# EAGLE design Dummy Load (EAGLE 6.5.0)
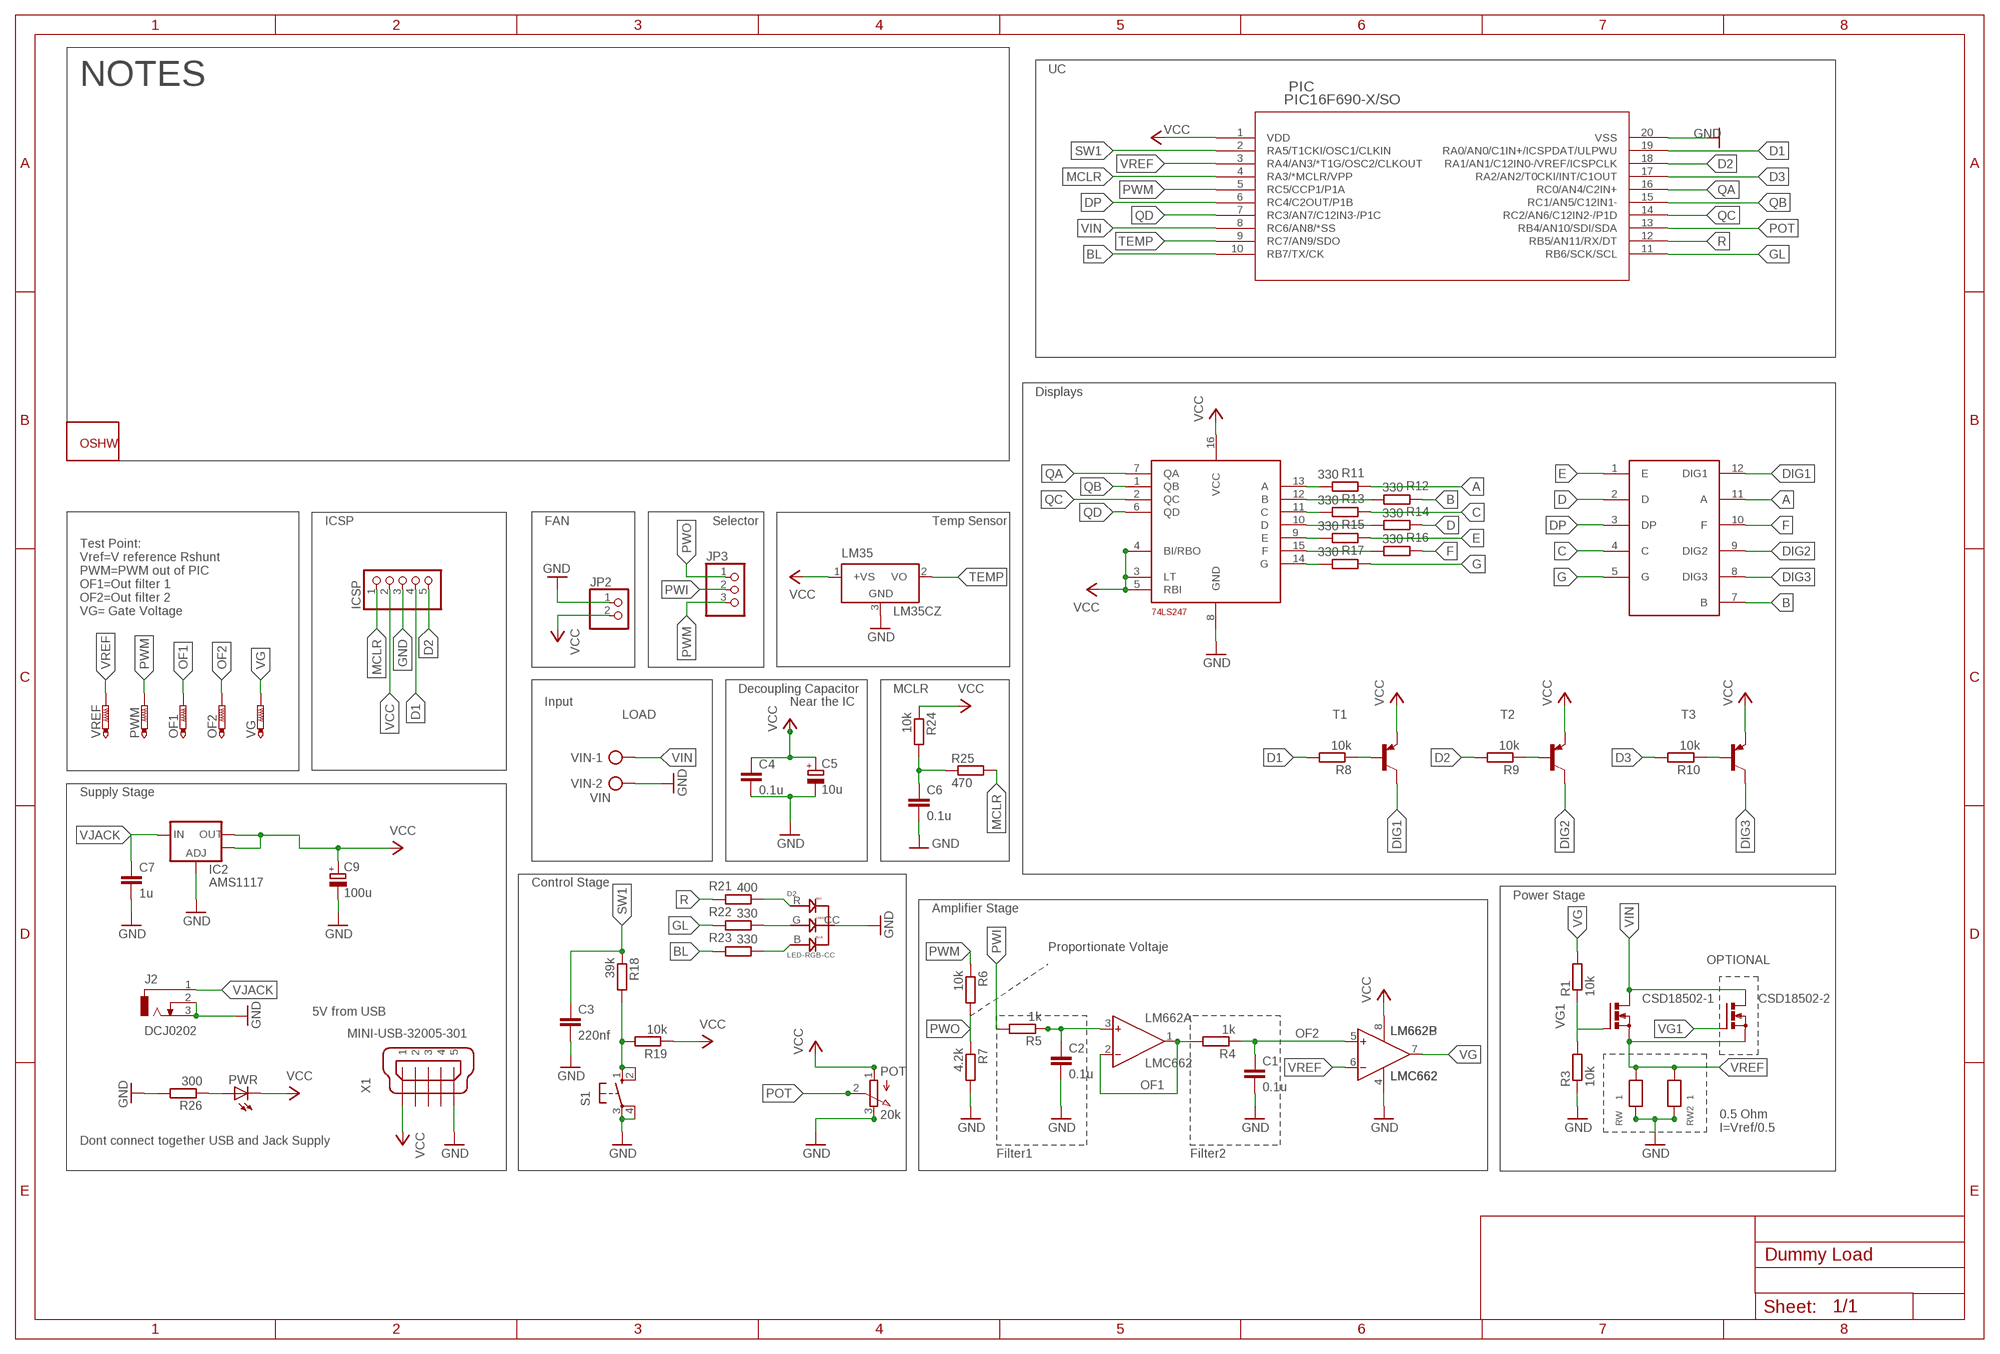
[diagram p0: schematic, sheet 1]

## Parts
74LS247  BCD-7  TLC5916/17  [SOIC-16]
C1  0.1u  C-EUC0805  [C0805]
C2  0.1u  C-EUC0805  [C0805]
C3  220nf  C-EUC0805  [C0805]
C4  0.1u  C-EUC0805  [C0805]
C5  10u  CPOL-EU153CLV-0405  [153CLV-0405]
C6  0.1u  C-EUC0805  [C0805]
C7  1u  C-EUC0805  [C0805]
C9  100u  CPOL-EU153CLV-0605  [153CLV-0605]
CSD18502-1  PMOSFET_NTO220BV  [TO220BV]
CSD18502-2  PMOSFET_NTO220BV  [TO220BV]
D2  LED-RGB-CC  [LED-RGB-CC]
DISPLAY  7-SEGMENT--DIGITS  [7-SEGMENT--DIGITS]
GOLD_ORB_SM2  OSHWLOGO_GOLD_ORB_MED  [OSHW1]
IC2  AMS1117  V_REG_LM1117SOT223  [SOT223]
ICSP  PINHD-1X5  [1X05]
J2  DCJ0202  [DCJ0202]
JP2  PINHD-1X2  [1X02]
JP3  PINHD-1X3  [1X03]
LM35  LM35CZ  [TO92]
LM662  LMC662  AD8033R  [SO8]
OF1  PTR1B1,27  [B1,27]
OF2  PTR1B1,27  [B1,27]
PIC  PIC16F690-X/SO  [SOIC20-W_MC]
POT  20k  3RP/1610N  [3RP/1610N]
PWM  PTR1B1,27  [B1,27]
PWR  LEDCHIP-LED0805  [CHIP-LED0805]
R1  10k  R-EU_R0805  [R0805]
R3  10k  R-EU_R0805  [R0805]
R4  1k  R-EU_R0805  [R0805]
R5  1k  R-EU_R0805  [R0805]
R6  10k  R-EU_R0805  [R0805]
R7  4.2k  R-EU_R0805  [R0805]
R8  10k  R-EU_R0805  [R0805]
R9  10k  R-EU_R0805  [R0805]
R10  10k  R-EU_R0805  [R0805]
R11  330  R-EU_R0805  [R0805]
R12  330  R-EU_R0805  [R0805]
R13  330  R-EU_R0805  [R0805]
R14  330  R-EU_R0805  [R0805]
R15  330  R-EU_R0805  [R0805]
R16  330  R-EU_R0805  [R0805]
R17  330  R-EU_R0805  [R0805]
R18  39k  R-EU_R0805  [R0805]
R19  10k  R-EU_R0805  [R0805]
R21  400  R-EU_R0805  [R0805]
R22  330  R-EU_R0805  [R0805]
R23  330  R-EU_R0805  [R0805]
R24  10k  R-EU_R0805  [R0805]
R25  470  R-EU_R0805  [R0805]
R26  300  R-EU_R0805  [R0805]
RW  1  RESISTOR5W  [RESISTOR5W]
RW2  1  RESISTOR5W  [RESISTOR5W]
S1  10-XX  [B3F-10XX]
T1  MMBT540LT1-PNP-SOT23-BEC  [SOT23-BEC]
T2  MMBT540LT1-PNP-SOT23-BEC  [SOT23-BEC]
T3  MMBT540LT1-PNP-SOT23-BEC  [SOT23-BEC]
VG  PTR1B1,27  [B1,27]
VIN  VIN  AK500/2-H  [AK500/2-H]
VREF  PTR1B1,27  [B1,27]
X1  MINI-USB-32005-301  [32005-301]

## Nets
A: DISPLAY.11(A) R11.1
B: DISPLAY.7(B) R12.1
BL: PIC.10(RB7/TX/CK) R23.2
C: DISPLAY.4(C) R13.1
D: DISPLAY.2(D) R14.1
D1: ICSP.4 PIC.19(RA0/AN0/C1IN+/ICSPDAT/ULPWU) R8.2
D2: ICSP.5 PIC.18(RA1/AN1/C12IN0-/VREF/ICSPCLK) R9.2
D3: PIC.17(RA2/AN2/T0CKI/INT/C1OUT) R10.2
DIG1: DISPLAY.12(DIG1) T1.C
DIG2: DISPLAY.9(DIG2) T2.C
DIG3: DISPLAY.8(DIG3) T3.C
DP: DISPLAY.3(DP) PIC.6(RC4/C2OUT/P1B)
E: DISPLAY.1(E) R15.1
F: DISPLAY.10(F) R16.1
G: DISPLAY.5(G) R17.1
GL: PIC.11(RB6/SCK/SCL) R22.2
GND: 74LS247.8(GND) C1.2 C2.2 C3.2 C4.2 C5.- C6.2 C7.2 C9.- D2.CC IC2.1(ADJ) ICSP.3 J2.2 J2.3 JP2.1 LM35.3(GND) LM662.4(P:V-) PIC.20(VSS) POT.3(E) R3.1 R7.2 R26.2 RW2.P$1 RW.P$1 S1.3(P) S1.4(P1) VIN.2 X1.5
MCLR: ICSP.1 PIC.4(RA3/*MCLR/VPP) R25.2
N$1: PWR.A R26.1
N$3: R8.1 T1.B
N$4: R10.1 T3.B
N$5: C2.1 LM662.3(A:IN+) R5.1
N$7: R9.1 T2.B
N$8: 74LS247.13(A) R11.2
N$9: 74LS247.12(B) R12.2
N$10: 74LS247.11(C) R13.2
N$11: 74LS247.10(D) R14.2
N$12: 74LS247.9(E) R15.2
N$13: 74LS247.15(F) R16.2
N$14: 74LS247.14(G) R17.2
N$15: R18.2 R19.2 S1.1(S) S1.2(S1)
N$16: D2.R R21.1
N$17: D2.G R22.1
N$18: D2.B R23.1
N$21: C6.1 R24.2 R25.1
OF1: LM662.1(A:OUT) LM662.2(A:IN-) OF1.TP R4.2
OF2: C1.1 LM662.5(B:IN+) OF2.TP R4.1
POT: PIC.13(RB4/AN10/SDI/SDA) POT.2(S)
PWI: JP3.2 R5.2
PWM: JP3.3 PIC.5(RC5/CCP1/P1A) PWM.TP R6.1
PWO: JP3.1 R6.2 R7.1
QA: 74LS247.7(QA) PIC.16(RC0/AN4/C2IN+)
QB: 74LS247.1(QB) PIC.15(RC1/AN5/C12IN1-)
QC: 74LS247.2(QC) PIC.14(RC2/AN6/C12IN2-/P1D)
QD: 74LS247.6(QD) PIC.7(RC3/AN7/C12IN3-/P1C)
R: PIC.12(RB5/AN11/RX/DT) R21.2
SW1: C3.1 PIC.2(RA5/T1CKI/OSC1/CLKIN) R18.1
TEMP: LM35.2(VO) PIC.9(RC7/AN9/SDO)
VCC: 74LS247.3(LT) 74LS247.4(BI/RBO) 74LS247.5(RBI) 74LS247.16(VCC) C4.1 C5.+ C9.+ IC2.2(OUT) IC2.4(OUT) ICSP.2 JP2.2 LM35.1(+VS) LM662.8(P:V+) PIC.1(VDD) POT.1(A) PWR.C R19.1 R24.1 T1.E T2.E T3.E X1.1
VG: LM662.7(B:OUT) R1.2 VG.TP
VG1: CSD18502-1.G CSD18502-2.G R1.1 R3.2
VIN [VIN]: CSD18502-1.D CSD18502-2.D PIC.8(RC6/AN8/*SS) VIN.1
VJACK: C7.1 IC2.3(IN) J2.1
VREF: CSD18502-1.S CSD18502-2.S LM662.6(B:IN-) PIC.3(RA4/AN3/*T1G/OSC2/CLKOUT) RW2.P$2 RW.P$2 VREF.TP
Unconnected: X1.2 X1.3 X1.4

## Notes on the sheet
- UC
- NOTES
- Displays
- ICSP | FAN | Selector | Temp Sensor
- Test Point:
  Vref=V reference Rshunt
  PWM=PWM out of PIC
  OF1=Out filter 1
  OF2=Out filter 2
  VG= Gate Voltage
- Decoupling Capacitor | MCLR
- Input | Near the IC
- LOAD
- Supply Stage
- Control Stage
- Power Stage
- Amplifier Stage
- Proportionate Voltaje
- OPTIONAL
- 5V from USB
- 0.5 Ohm 
  I=Vref/0.5
- Dont connect together USB and Jack Supply
- Filter1 | Filter2

## Library data of the parts
74LS247 = BillPorter:TLC5916/17: SN74LS247 BCD-To-Seven-Segment Decoders/Drivers
C1-C4 C6 C7 = rcl:C-EU: CAPACITOR, European symbol
C5 C9 = rcl:CPOL-EU: POLARIZED CAPACITOR, European symbol
CSD18502-1 CSD18502-2 = transistor-power:PMOSFET_N: Power MOSFET N-Channel
D2 = Triggerr:LED-RGB-CC
DISPLAY = 7-Segment-3Digits:7-SEGMENT--DIGITS
GOLD_ORB_SM2 = NBitWonder:OSHWLOGO: These are Open-Source Hardware logos.
IC2 = SparkFun-PowerIC:V_REG_LM1117: Voltage Regulator LM1117 Standard adjustable voltage regulator but in SMD form. Spark Fun Electronics SKU : COM-00595; PROD_ID: VREG-08170
ICSP = pinhead:PINHD-1X5: PIN HEADER
J2 = con-jack:DCJ0202: DC POWER JACK Source: DCJ0202.pdf; OC_FARNELL: unknown; OC_NEWARK: unknown
JP2 = pinhead:PINHD-1X2: PIN HEADER
JP3 = pinhead:PINHD-1X3: PIN HEADER
LM35 = lm35:LM35: Single-Supply Centigrade Temperature Sensor Vout = (10mV/°C x Temp °C) +5mmmV Source: http://www.national.com/ds/LM/LM35.pdf
LM662 = analog-devices:AD8033: 2.7 V, 800 ?A, 80 MHz Rail-to-Rail I/O Amplifiers Source: http://www.analog.com/static/imported-files/data_sheets/AD8031_8032.pdf; MF: ALTERA CORPORATION; MPN: AD8033ARZ; OC_FARNELL: 8621519; OC_NEWARK: 59K6245
OF1 OF2 PWM VG VREF = testpad:PTR1: TEST PIN
PIC = 16F690SOIC:PIC16F690-X/SO
POT = pot:3RP/1610N: 16mm Potentiometer one level Source: http://www.alphapotentiometers.net/html/16mm_pot_2.html
PWR = led:LED: LED OSRAM: - CHIPLED LG R971, LG N971, LY N971, LG Q971, LY Q971, LO R971, LY R971 LH N974, LH R974 LS Q976, LO Q976, LY Q976 LO Q996 - Hyper CHIPLED LW Q18S LB Q993, LB Q99A, LB R99A - SideLED LS A670, LO A670, LY A670, LG A670, LP A670 LB A673, LV A673, LT A673, LW A673 LH A674 LY A675 LS A676, LA A676, LO A676, LY A676, LW A676 LS A679, LY A679, LG A679 - Hyper Micro SIDELED® LS Y876, LA Y876, LO Y876, LY Y876 LT Y87S - SmartLED LW L88C, LW L88S LB L89C, LB L89S, LG L890 LS L89K, LO L89K, LY L89K LS L896, LA L896, LO L896, LY L896 - TOPLED LS T670, LO T670, LY T670, LG T670, LP T670 LSG T670, LSP T670, LSY T670, LOP T670, LYG T670 LG T671, LOG T671, LSG T671 LB T673, LV T673, LT T673, LW T673 LH T674 LS T676, LA T676, LO T676, LY T676, LB T676, LH T676, LSB T676, LW T676 LB T67C, LV T67C, LT T67C, LS T67K, LO T67K, LY T67K, LW E67C LS E67B, LA E67B, LO E67B, LY E67B, LB E67C, LV E67C, LT E67C LW T67C LS T679, LY T679, LG T679 LS T770, LO T770, LY T770, LG T770, LP T770 LB T773, LV T773, LT T773, LW T773 LH T774 LS E675, LA E675, LY E675, LS T675 LS T776, LA T776, LO T776, LY T776, LB T776 LHGB T686 LT T68C, LB T68C - Hyper Mini TOPLED® LB M676 - Mini TOPLED Santana® LG M470 LS M47K, LO M47K, LY M47K Source: http://www.osram.convergy.de LUXEON: - LUMILED® LXK2-PW12-R00, LXK2-PW12-S00, LXK2-PW14-U00, LXK2-PW14-V00 LXK2-PM12-R00, LXK2-PM12-S00, LXK2-PM14-U00 LXK2-PE12-Q00, LXK2-PE12-R00, LXK2-PE12-S00, LXK2-PE14-T00, LXK2-PE14-U00 LXK2-PB12-K00, LXK2-PB12-L00, LXK2-PB12-M00, LXK2-PB14-N00, LXK2-PB14-P00, LXK2-PB14-Q00 LXK2-PR12-L00, LXK2-PR12-M00, LXK2-PR14-Q00, LXK2-PR14-R00 LXK2-PD12-Q00, LXK2-PD12-R00, LXK2-PD12-S00 LXK2-PH12-R00, LXK2-PH12-S00 LXK2-PL12-P00, LXK2-PL12-Q00, LXK2-PL12-R00 Source: www.luxeon.com KINGBRIGHT: KA-3528ASYC Source: www.kingbright.com
R1 R3-R19 R21-R26 = rcl:R-EU_: RESISTOR, European symbol
RW RW2 = Triggerr:RESISTOR5W
S1 = switch-omron:10-XX: OMRON SWITCH; MPN: B3F-1000; OC_FARNELL: 176432; OC_NEWARK: 36M3542
T1-T3 = transistor:*-PNP-: PNP Transistror
VIN = con-ptr500:AK500/2-H: CONNECTOR Aug. 2004 / PTR Meßtechnik: Die Bezeichnung der Serie AK505 wurde geändert. Es handelt sich hierbei um AK500 in horizontaler Ausführung.; OC_FARNELL: unknown; OC_NEWARK: unknown
X1 = con-cypressindustries:MINI-USB-: MINI USB-B Conector Source: www.cypressindustries.com; OC_FARNELL: unknown; OC_NEWARK: unknown

## Net classes
1 VIN: width 3 mm

## Board
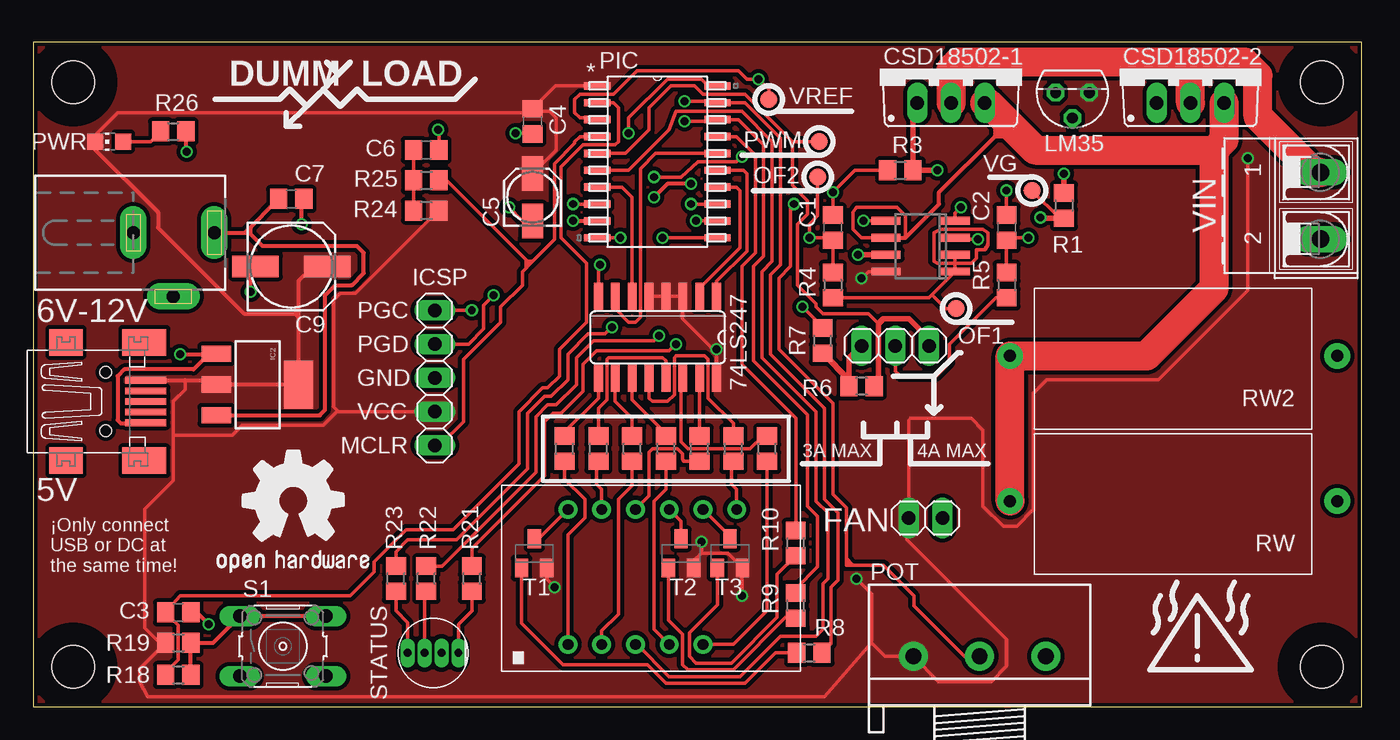
[diagram p1: board, top side]
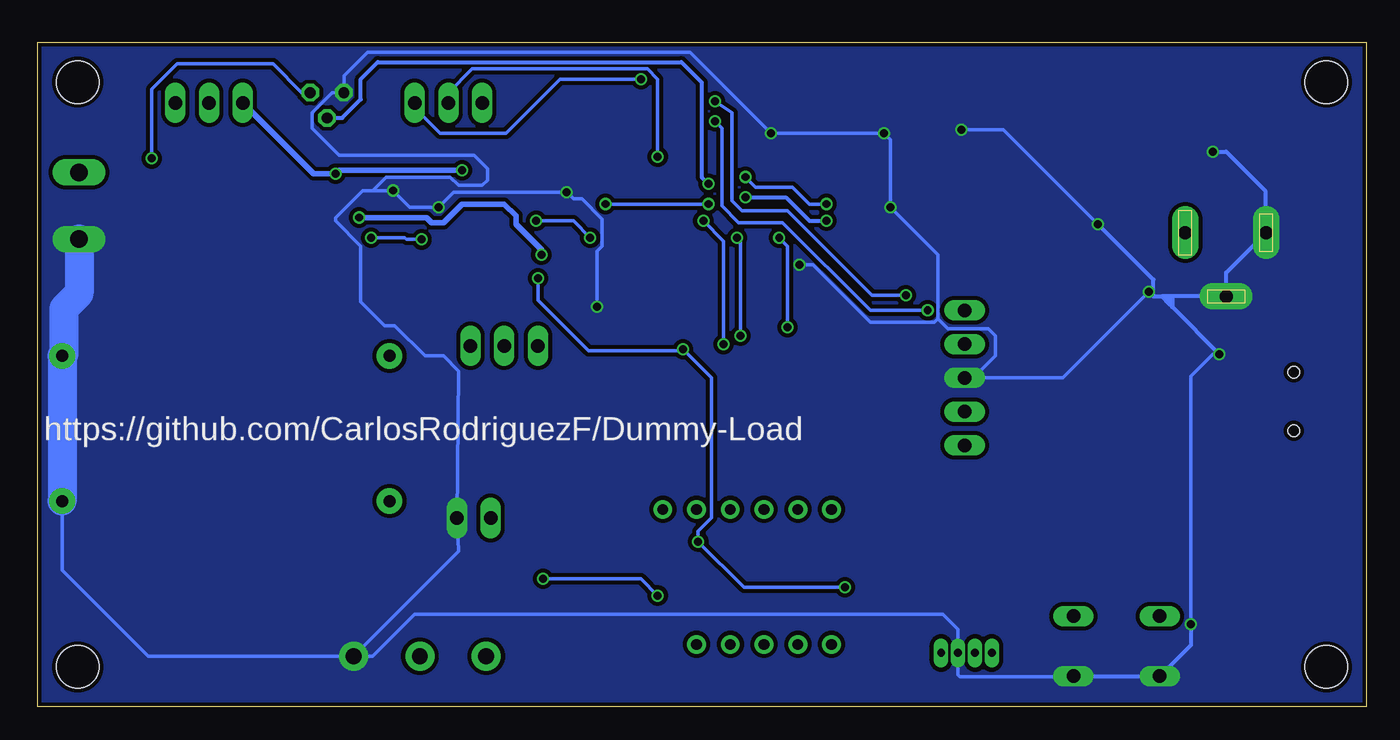
[diagram p2: board, bottom side, seen from below]

Size 100 x 50 mm. Coordinates in mm from the lower left corner, seen from the top.
Outline: 0,0 100,0 100,50 0,50 0,0
Copper layers (1*16): Top 0.035mm / dielectric 1.5mm / Bottom 0.035mm
Design rules "SeeedStudio_2layer_DRU_no_angle_20140221": minimum track width 6mil, minimum drill 12mil, track to track 6mil, track to pad 6mil, pad to pad 6mil, via to via 6mil, smd to smd 0mil, copper to edge 10mil, drill to drill 10mil, minimum pad ring 10mil, minimum via ring 6mil, stop-mask expansion 2mil, vias tented up to drill 100mil, thermal gap 10mil
Holes 3.2 mm at 3,47 3,3 97,3 97,47
tRestrict: area 0,0 to 6,6; area 94,0 to 100,6; area 94,44 to 100,50; area 0,44 to 6,50

### Footprints (pad centres in the part's own frame; a part is rotated, then mirrored left to right if it is on the bottom)
SOIC-16 = smd 0.66 x 2.032: 1 -4.075,-3.073; 2 -2.805,-3.073; 3 -1.535,-3.073; 4 -0.265,-3.073; 5 1.005,-3.073; 6 2.275,-3.073; 7 3.545,-3.073; 8 4.815,-3.073; 9 4.815,3.073; 10 3.545,3.073; 11 2.275,3.073; 12 1.005,3.073; 13 -0.265,3.073; 14 -1.535,3.073; 15 -2.805,3.073; 16 -4.075,3.073
C0805 = smd 1.3 x 1.5: 1 -0.95,0; 2 0.95,0
153CLV-0405 = smd 2.6 x 1.6: + 1.8,0; - -1.8,0
153CLV-0605 = smd 3.5 x 1.6: + 2.7,0; - -2.7,0
TO220BV = drill 1.016 long: D 0,-2.54; G -2.54,-2.54; S 2.54,-2.54
LED-RGB-CC = drill 0.6 pad 0.813 long: B 0,0; CC 2.54,0; G 1.27,0; R 3.81,0
7-SEGMENT--DIGITS = drill 0.8 pad 1.422: 1 0,0; 2 2.54,0; 3 5.08,0; 4 7.62,0; 5 10.16,0; 7 12.7,10.16; 8 10.16,10.16; 9 7.62,10.16; 10 5.08,10.16; 11 2.54,10.16; 12 0,10.16
SOT223 = smd 1.219 x 2.235: 1 -2.311,-3.099; 2 0,-3.099; 3 2.311,-3.099 | smd 3.6 x 2.2: 4 0,3.099
1X05 = drill 1.016 long: 1 -5.08,0; 2 -2.54,0; 3 0,0; 4 2.54,0; 5 5.08,0
DCJ0202 = drill 1 pad 2 long: 1 0,3.1; 2 4.8,0; 3 0,-3
1X02 = drill 1.016 long: 1 -1.27,0; 2 1.27,0
1X03 = drill 1.016 long: 1 -2.54,0; 2 0,0; 3 2.54,0
TO92 = drill 0.813 octagon: 1 -1.27,0; 2 0,1.905; 3 1.27,0
SO8 = smd 0.6 x 2.2: 1 -1.905,-2.6; 2 -0.635,-2.6; 3 0.635,-2.6; 4 1.905,-2.6; 5 1.905,2.6; 6 0.635,2.6; 7 -0.635,2.6; 8 -1.905,2.6
B1,27 = smd 1.27 x 1.27: TP 0,0
SOIC20-W_MC = smd 1.981 x 0.559: 1 -4.521,5.715; 2 -4.521,4.445; 3 -4.521,3.175; 4 -4.521,1.905; 5 -4.521,0.635; 6 -4.521,-0.635; 7 -4.521,-1.905; 8 -4.521,-3.175; 9 -4.521,-4.445; 10 -4.521,-5.715; 11 4.521,-5.715; 12 4.521,-4.445; 13 4.521,-3.175; 14 4.521,-1.905; 15 4.521,-0.635; 16 4.521,0.635; 17 4.521,1.905; 18 4.521,3.175; 19 4.521,4.445; 20 4.521,5.715
3RP/1610N = drill 1.2 pad 2.184: 1 -5,0; 2 0,0; 3 5,0
CHIP-LED0805 = smd 1.2 x 1.2: A 0,-1.05; C 0,1.05
R0805 = smd 1.3 x 1.5: 1 -0.95,0; 2 0.95,0
RESISTOR5W = drill 0.9 pad 1.93: P$1 -1.905,5.08; P$2 22.733,5.08
B3F-10XX = drill 1.016 long: 1 -3.251,2.261; 2 3.251,2.261; 3 -3.251,-2.261; 4 3.251,-2.261
SOT23-BEC = smd 1 x 1.4: B -0.95,-1.1; C 0,1.1; E 0.95,-1.1
AK500/2-H = drill 1.321 long: 1 -2.515,0; 2 2.515,0
32005-301 = smd 3.1 x 0.5: 1 3,1.6; 2 3,0.8; 3 3,0; 4 3,-0.8; 5 3,-1.6 | smd 2.5 x 2: M1 -3,-4.45; M2 -3,4.45 | smd 3.3 x 2: M3 2.9,4.45; M4 2.9,-4.45 | hole 0.9: 0,2.2; 0,-2.2

### Placement (x,y rotation side)
74LS247  47.37,27.8 180 top
C1  60.2,36.05 90 top
C2  73.28,36.05 90 top
C3  10.92,7.1 0 top
C4  37.59,44.05 270 top
C5  37.59,38.34 90 top
C6  29.59,41.89 0 top
C7  19.43,38.21 0 top
C9  19.43,33.13 0 top
CSD18502-1  69.09,47.99 0 top
CSD18502-2  87.12,47.99 0 top
D2  28.19,4.05 0 top
DISPLAY  40.26,4.68 0 top
GOLD_ORB_SM2  13.21,8.37 0 top
IC2  16.89,24.24 270 top
ICSP  30.23,24.75 90 top
J2  10.54,35.67 270 top
JP2  67.18,14.21 180 top
JP3  64.9,27.16 0 top
LM35  78.23,46.21 180 top
LM662  66.8,34.66 90 top
OF1  69.47,29.96 0 top
OF2  59.05,39.86 0 top
PIC  46.99,41.01 0 top
POT  71.25,3.79 0 top
PWM  59.18,42.53 0 top
PWR  5.71,42.53 90 top
R1  77.6,37.7 270 top
R3  65.28,40.37 0 top
R4  60.2,31.73 270 top
R5  73.28,31.73 270 top
R6  62.36,24.11 180 top
R7  59.44,27.54 90 top
R8  58.42,4.05 0 top
R9  57.4,7.6 90 top
R10  57.4,12.3 90 top
R11  42.55,19.41 90 top
R12  52.7,19.41 90 top
R13  47.62,19.41 90 top
R14  45.09,19.41 90 top
R15  40.01,19.41 90 top
R16  50.16,19.41 90 top
R17  55.24,19.41 90 top
R18  10.92,2.4 0 top
R19  10.92,4.81 0 top
R21  33.02,9.64 90 top
R22  29.59,9.64 90 top
R23  27.3,9.64 90 top
R24  29.59,37.32 180 top
R25  29.59,39.61 0 top
R26  10.54,43.29 0 top
RW  96.27,20.56 180 top
RW2  96.27,31.48 180 top
S1  18.8,4.56 0 top
T1  37.72,11.54 0 top
T2  48.77,11.54 0 top
T3  52.45,11.54 0 top
VG  75.18,38.85 0 top
VIN  96.9,37.7 270 top
VREF  55.37,45.7 0 top
X1  5.46,22.97 0 top

### Tracks (layer width: path | path; a pad name or v marks a point on that pad's centre or on a via)
A
  Top 0.254: DISPLAY.11 42.8,16.37 42.42,16.75 42.42,18.34 R11.1
B
  Top 0.254: DISPLAY.7 52.96,16.37 52.58,16.75 52.58,18.34 R12.1
BL  (via drill 0.6)
  Top 0.254: R23.2 27.3,11.67 28.19,12.56 31.88,12.56 37.21,17.89 37.21,22.08 38.48,23.35 38.99,23.35 40.26,24.62 40.26,26.53 41.78,28.05 43.05,28.05 v43.56,28.56 | v44.2,35.29 PIC.10
  Bottom 0.254: v43.56,28.56 43.56,34.66 v44.2,35.29
C
  Top 0.254: R13.1 47.62,16.37 46.74,15.48 46.74,5.83 DISPLAY.4
D
  Top 0.254: R14.1 45.09,16.62 44.07,15.61 44.07,6.97 42.8,5.7 DISPLAY.2
D1  (via drill 0.6)
  Top 0.254: R8.2 60.07,4.75 60.07,9 60.58,9.51 60.58,14.59 59.56,15.61 59.56,22.46 55.5,26.53 55.5,32.5 56.26,33.26 56.26,42.78 53.59,45.45 PIC.19 50.93,45.45 50.55,45.58 v49.02,45.58 | ICSP.4 32.77,27.29 33.91,28.43 33.91,30.21 v34.67,30.97
  Bottom 0.254: v34.67,30.97 37.21,30.97 43.56,37.32 46.99,37.32 47.75,38.08 47.75,44.69 v49.02,45.58
D2  (via drill 0.6)
  Top 0.254: R9.2 57.4,8.87 59.05,10.53 59.05,14.34 58.29,15.1 58.29,21.95 54.23,26.02 54.23,33.13 54.99,33.89 54.99,42.27 53.09,44.18 PIC.18 51.38,44.05 v49.02,44.05 | ICSP.5 v33.02,29.83
  Bottom 0.254: v33.02,29.83 37.34,29.83 43.94,36.43 47.24,36.43 48.51,37.7 48.51,43.55 v49.02,44.05
D3
  Top 0.254: R10.2 57.4,21.7 53.34,25.77 53.34,33.13 54.36,34.15 54.36,41.51 52.96,42.91 PIC.17
DIG1
  Top 0.254: T1.C 38.06,12.64 DISPLAY.12
DIG2
  Top 0.254: T2.C 48.77,13.95 DISPLAY.9
DIG3
  Top 0.254: T3.C 52.45,12.81 DISPLAY.8
DP
  Top 0.254: DISPLAY.3 45.47,4.68 47.88,2.27 53.21,2.27 56.26,5.32 58.93,5.32 59.44,5.83 59.44,9.26 59.82,9.64 59.82,14.59 58.93,15.48 58.93,22.21 54.86,26.27 54.86,32.75 55.63,33.51 55.63,42.53 53.34,44.81 48.39,44.81 47.88,43.42 44.83,40.37 PIC.6
E
  Top 0.254: DISPLAY.1 40.26,12.94 41.53,14.21 41.53,15.61 40.01,17.13 R15.1
F
  Top 0.254: DISPLAY.10 46.35,15.86 46.35,19.16 46.61,19.41 48.51,19.41 48.9,19.03 48.9,18.65 48.96,18.46 R16.1
G
  Top 0.254: DISPLAY.5 52.7,4.68 55.24,7.22 R17.1
GL  (via drill 0.6)
  Top 0.254: R22.2 30.8,10.59 37.85,17.64 37.85,21.83 38.73,22.72 39.37,22.72 40.89,24.24 40.89,26.27 42.16,27.54 46.74,27.54 v47.12,27.92 | v47.37,35.29 PIC.11
  Bottom 0.254: v47.12,27.92 47.12,35.04 v47.37,35.29
GND  (via drill 0.6)
  Top 0.254: C6.2 30.54,43.36 v30.48,43.42 | C5.- 36.85,36.54 v35.81,37.58 | v36.32,43.16 37.53,43.16 C4.2 | 74LS247.8 42.56,33.14 v42.67,33.26 | LM662.4 69.4,37.13 v69.85,37.58 | v73.28,38.85 C2.2 | C1.2 v60.2,38.72 61.85,40.37 R3.1 | R7.2 59.44,28.56 v57.91,30.08 | PIC.20 50.8,46.72 50.29,47.23 47.75,47.23 44.83,44.31 v44.83,43.16
  Top 0.305: v16.38,31.23 16.38,32.78 C9.- | v20.19,36.31 20.19,38.02 C7.2 | v11.05,26.53 13.77,26.53 IC2.1 13.23,26.55 12.06,25.38 6.86,25.38 6.35,24.88 6.35,21.57 6.6,21.32 7.87,21.32 8,21.45 8.38,21.45 X1.5 | R26.2 11.49,41.83 v11.56,41.77 | C3.2 12.32,7.1 v13.21,6.21
  Bottom 0.254: v13.21,6.21 13.21,24.88 11.56,26.53 v11.05,26.53 | S1.4 22.07,2.27 30.61,2.27 30.73,2.4 D2.CC 30.73,5.83 31.88,6.97 71.63,6.97 74.8,3.79 POT.3 | v16.38,31.23 22.86,24.75 ICSP.3 29.59,24.75 27.94,26.4 27.94,27.92 28.45,28.43 31.5,28.43 32.26,29.19 | v30.48,43.42 27.3,43.42 v20.19,36.31 | v42.67,33.26 41.66,33.26 37.34,28.94 32.51,28.94 32.26,29.19 | 32.26,29.19 32.26,34.02 v35.81,37.58 35.81,42.66 v36.32,43.16 v44.83,43.16 50.93,49.26 75.18,49.26 76.96,47.48 LM35.3 77.85,46.21 79.38,44.69 79.38,43.55 77.34,41.51 67.18,41.51 66.17,40.5 66.17,39.61 66.55,39.23 68.33,39.23 68.96,39.86 73.79,39.86 74.8,38.85 | RW.P$1 98.17,10.27 91.69,3.79 POT.3 | v57.91,30.08 57.91,34.27 57.53,34.66 57.53,36.69 59.05,38.21 59.69,38.21 v60.2,38.72 68.71,38.72 v69.85,37.58 72.01,37.58 v73.28,38.85 74.8,38.85 | POT.3 68.33,11.71 JP2.1 68.33,25.26 69.47,26.4 70.87,26.4 73.15,28.69 73.91,28.69 75.69,30.46 75.69,34.66 77.6,36.56 77.6,36.81 75.56,38.85 74.8,38.85
  Bottom 0.305: 7.62,35.59 10.54,32.67 J2.2 15.39,30.87 | 7.62,35.59 J2.3 | 16.03,30.87 v16.38,31.23 | 16.03,30.87 16.03,32.14 v20.19,36.31 | 16.03,30.87 15.39,30.87 | 15.39,30.87 14.86,30.34 | 14.86,30.34 14.61,30.08 | 14.61,30.08 v11.05,26.53 | 14.99,30.72 14.86,30.72 14.86,30.34 | 14.61,30.84 14.61,30.08 | v11.56,41.77 10.54,41.77 7.62,38.85 7.62,35.59 | S1.4 S1.3 13.21,4.63 v13.21,6.21
  Bottom 2.184: VIN.2 96.9,31.1 98.04,29.96 98.04,26.53 RW2.P$1 RW.P$1
  pour Bottom (isolate 0.305, no thermals): 0,0 100,0 100,50 0,50
MCLR
  Top 0.254: ICSP.1 30.61,19.67 32.38,21.45 32.38,26.15 35.18,28.94 35.18,30.08 36.83,31.73 36.83,32.75 37.08,33 | 37.08,33 37.34,33.26 | 37.4,33.32 37.59,33.51 | 37.59,33.51 39.24,35.16 39.24,40.88 40.77,42.4 40.77,42.53 41.15,42.91 PIC.4 | R25.2 31.11,39.61 37.4,33.32 | 37.08,33 37.08,33.51 | 37.08,33.51 37.34,33.26 | 37.34,33.26 37.4,33.32 | 37.59,33.51 37.08,33.51
N$1
  Top 0.254: PWR.A 8.83,42.53 R26.1
N$3
  Top 0.254: T1.B 36.77,6.27 39.88,3.16 46.23,3.16 47.62,1.76 53.59,1.76 55.88,4.05 R8.1
N$4
  Top 0.254: T3.B 51.5,7.67 49.4,5.57 49.4,3.79 49.91,3.29 52.58,3.29 56.01,6.71 56.01,9.96 R10.1
N$5  (via drill 0.6)
  Top 0.254: 73.09,35.29 C2.1 | LM662.3 70.36,35.16 v71.12,35.16 | v74.93,35.29 73.47,35.29 C2.1 | C2.1 R5.1
  Bottom 0.254: v71.12,35.16 72.26,35.16 72.39,35.29 v74.93,35.29
N$7
  Top 0.254: T2.B 47.82,6.52 48.9,5.45 48.9,3.16 49.28,2.78 52.7,2.78 56.64,6.71 57.34,6.71 R9.1
N$8
  Top 0.254: R11.2 42.55,22.46 43.18,23.1 43.18,26.15 43.31,26.27 47.37,26.27 47.62,26.02 47.62,24.73 74LS247.13
N$9
  Top 0.254: R12.2 52.7,21.32 50.8,23.23 50.8,26.15 50.55,26.4 48.39,26.4 48.26,26.27 48.26,23.48 47.75,22.97 46.61,22.97 46.35,23.23 46.35,24.71 74LS247.12
N$10
  Top 0.254: R13.2 47.62,20.56 45.09,23.1 45.09,24.71 74LS247.11
N$11
  Top 0.254: R14.2 45.09,21.7 43.81,22.97 43.81,24.71 74LS247.10
N$12
  Top 0.254: R15.2 40.01,20.68 42.55,23.23 42.55,24.71 74LS247.9
N$13
  Top 0.254: R16.2 50.16,24.71 74LS247.15
N$14
  Top 0.254: R17.2 54.92,20.36 53.98,19.41 49.28,19.41 48.77,19.92 48.77,24.71 74LS247.14
N$15
  Top 0.305: S1.2 S1.1 13.54,4.81 R19.2 R18.2
N$16
  Top 0.254: D2.R 32,6.21 33.02,7.22 R21.1
N$17
  Top 0.254: D2.G 29.46,8.56 R22.1
N$18
  Top 0.254: D2.B 28.19,6.33 27.3,7.22 R23.1
N$21
  Top 0.254: C6.1 R25.1 R24.2
OF1
  Top 0.254: 69.34,33.38 68.07,33.38 67.82,33.51 67.82,35.67 68.33,35.92 71.5,35.92 71.88,35.67 71.88,34.78 71.63,34.4 70.99,34.4 70.99,33.77 70.61,33.38 69.34,33.38 | 69.34,33.38 69.4,33.45 LM662.2 LM662.1 67.66,31.01 | R4.2 67.44,30.78 67.66,31.01 | OF1.TP 68.71,29.96 67.66,31.01
OF2  (via drill 0.6)
  Top 0.254: R4.1 C1.1 60.01,35.29 v58.42,35.29 58.42,36.31 59.05,36.94 OF2.TP | LM662.5 v62.48,36.56
  Bottom 0.254: v62.48,36.56 59.69,36.56 v58.42,35.29
POT  (via drill 0.6)
  Top 0.254: 61.72,10.65 64.01,10.65 66.29,8.37 66.29,7.6 70.1,3.79 POT.2 | 61.47,10.65 61.21,10.65 61.21,10.91 | 61.21,10.91 61.21,11.16 | 61.21,11.16 61.21,14.97 60.2,15.99 60.2,22.84 56.13,26.91 56.13,32.24 57.02,33.13 57.02,37.58 v57.28,37.83 | v49.53,37.83 PIC.13 | 61.21,11.16 61.72,10.65 | 61.72,10.65 61.47,10.65 | 61.47,10.65 61.21,10.91
  Bottom 0.254: v57.28,37.83 v49.53,37.83
PWI
  Top 0.254: R5.2 72.46,30.78 68.96,27.29 68.96,25.89 67.94,24.88 65.28,24.88 64.9,25.26 JP3.2
PWM
  Top 0.254: PIC.5 44.58,41.64 46.35,43.42 46.35,45.07 48.01,46.72 49.78,46.72 50.42,46.09 53.59,46.09 57.15,42.53 | 57.15,42.53 57.15,39.23 58.29,38.08 58.29,37.07 57.53,36.31 57.53,31.73 58.93,30.34 58.93,30.08 59.44,29.57 62.87,29.57 63.63,28.81 | PWM.TP 57.15,42.53
  Top 0.406: JP3.3 67.44,27.67 65.91,29.19 64.01,29.19 63.63,28.81 63.63,24.43 R6.1
PWO
  Top 0.406: R6.2 61.41,24.62 | 61.41,24.62 R7.1 | 61.41,24.62 61.41,26.21 JP3.1
QA
  Top 0.254: 74LS247.7 43.83,29.95 44.83,28.94 45.34,28.94 45.72,29.32 45.72,40.5 46.86,41.64 PIC.16
QB
  Top 0.254: 74LS247.1 51.45,32 53.72,34.27 53.72,40.12 53.47,40.37 PIC.15
QC
  Top 0.254: 74LS247.2 50.18,31.49 53.21,34.53 53.21,38.85 52.96,39.1 PIC.14
QD
  Top 0.254: 74LS247.6 45.1,38.33 44.32,39.1 PIC.7
R  (via drill 0.6)
  Top 0.254: R21.2 33.02,11.92 38.48,17.38 38.48,21.45 39.12,22.08 39.75,22.08 41.4,23.73 41.4,25.77 42.42,26.78 47.88,26.78 v48.39,27.29 | v49.91,36.56 PIC.12
  Bottom 0.254: v48.39,27.29 48.39,35.04 v49.91,36.56
SW1
  Top 0.254: R18.1 9.97,2.59 10.92,3.54 10.92,6.15 C3.1 11.05,8.37 23.88,8.37 25.65,10.14 25.65,10.91 28.07,13.32 31.62,13.32 36.58,18.27 36.58,22.21 38.35,23.99 38.73,23.99 39.62,24.88 39.62,26.91 41.66,28.94 41.66,33.38 39.75,35.29 39.75,40.62 41.4,42.27 43.81,42.27 44.07,42.53 44.07,45.07 43.69,45.45 PIC.2
  Top 0.305: R18.1 9.59,1.89
TEMP  (via drill 0.6)
  Top 0.305: v49.53,39.35 47.75,39.35 v46.74,38.34 | v40.64,36.56 PIC.9
  Bottom 0.305: LM35.2 77.09,44.31 75.69,45.7 75.69,47.23 74.42,48.5 51.56,48.5 50.04,46.97 50.04,39.86 v49.53,39.35 | v46.74,38.34 43.69,38.34 41.91,36.56 v40.64,36.56
VCC  (via drill 0.6)
  Top 0.254: 10.54,20.3 10.54,17 8.38,14.84 8.38,5.95 9.53,4.81 R19.1 8,2.84 8,1.89 8.64,0.75 59.56,0.75 63.12,4.81 | 10.54,20.3 10.54,22.97 11.43,23.86 11.43,24.57 | T2.E 49.72,10.97 50.29,11.54 | 50.29,11.54 52.3,11.54 T3.E 53.34,10.38 v53.34,8.37 | 50.29,11.54 v50.29,12.43 | 74LS247.16 51.44,24.73 v51.44,26.91 51.18,26.91 48.9,29.19 48.9,30.86 74LS247.3 74LS247.4 74LS247.5 | T1.E 38.67,9.57 v39.24,9 | PIC.1 39.31,46.72 C4.1 | C5.+ 37.61,40.14 39.37,41.89 39.37,44.31 38.86,44.81 37.78,44.81 C4.1 | ICSP.2 22.99,22.21 | 22.99,22.21 22.86,22.21 21.84,21.19 15.75,21.19 14.99,20.43 10.67,20.43 10.54,20.3 | R24.1 30.48,37.32 24.26,31.1 23.11,31.1 22.61,30.59 22.61,22.59 22.99,22.21 | 63.12,4.81 63.12,8.49 v61.98,9.64 | PWR.C 4.67,43 6.35,44.69 37.28,44.69 C4.1 | 63.12,4.81 64.14,3.79 POT.1 68.15,1.89 72.14,1.89 73.28,3.03 73.28,5.06 65.79,12.56 JP2.2 65.91,21.57 66.04,21.7 70.61,21.7 71.5,20.81 71.5,15.1 73.03,13.57 74.04,13.57 75.31,14.84 75.31,23.61 76.33,24.62 84.71,24.62 91.44,31.35 v91.44,41.26 | LM662.8 62.87,32.75 v62.36,32.24
  Top 0.305: X1.1 11.43,24.57 13.46,24.57 IC2.2 IC2.4 19.99,29.32 | 19.99,29.32 19.99,32.04 20.95,33 22,33 C9.+ | PWR.C 4.41,42.18 9.4,37.2 9.4,36.05 15.88,29.57 19.74,29.57 19.99,29.32 | 19.81,29.57 19.81,29.96 19.94,30.08
  Bottom 0.254: v39.24,9 46.86,9 v50.29,12.43 50.29,13.19 49.28,14.21 49.28,24.75 v51.44,26.91 51.56,26.78 58.55,26.78 62.36,30.59 v62.36,32.24 | v61.98,9.64 54.61,9.64 v53.34,8.37 | LM35.1 80.14,46.21 82.3,48.37 89.53,48.37 91.44,46.47 v91.44,41.26
  pour Top (isolate 0.305, no thermals): 0,50 0,0 100,0 100,50
VG  (via drill 0.6)
  Top 0.254: R1.2 77.28,36.75 VG.TP
  Top 0.406: LM662.7 v62.1,34.02 | R1.2 75.88,36.75 v75.82,36.81
  Bottom 0.406: v62.1,34.02 62.1,34.4 64.01,36.31 64.01,36.94 64.9,37.83 68.07,37.83 69.47,36.43 70.36,36.43 70.74,36.81 v75.82,36.81
VG1  (via drill 0.6)
  Top 0.406: CSD18502-1.G 66.23,45.13 R3.2 v68.07,40.37 | R1.1 v77.6,40.12
  Bottom 0.406: CSD18502-2.G 79.25,40.12 v77.6,40.12 77.34,40.37 v68.07,40.37
VIN  (via drill 0.6)
  Top 0.254: PIC.8 v40.64,37.83 | v46.74,39.86 48.77,39.86 50.04,41.01 52.96,41.01 v53.34,41.39
  Top 2.184: CSD18502-2.D 87.12,47.99 86.61,48.5 | 86.61,48.5 69.6,48.5 69.09,47.99 CSD18502-1.D | VIN.1 96.42,40.22 92.2,44.43 92.2,47.48 91.19,48.5 86.61,48.5
  Bottom 0.254: CSD18502-1.D 69.09,46.21 67.31,47.99 54.1,47.99 53.34,47.23 v53.34,41.39 | v40.64,37.83 41.91,37.83 43.18,39.1 45.97,39.1 v46.74,39.86
VJACK
  Top 0.305: J2.1 15.94,35.67 | 15.94,35.67 16.1,35.83 | 16.1,35.83 C7.1 | IC2.3 21.57,21.93 21.97,22.34 21.97,30.97 22.73,31.73 24,31.73 24.89,32.62 24.89,34.15 24.38,34.66 17.27,34.66 16.38,35.54 | 16.38,35.54 16.26,35.67 | 16.26,35.67 16.1,35.83 | 16.38,35.54 16.38,36.05 | 15.94,35.67 16.26,35.67
VREF  (via drill 0.6)
  Top 0.254: PIC.3 42.34,44.31 41.15,44.31 40.77,44.69 40.77,45.7 41.15,46.09 43.69,46.09 45.47,47.86 53.09,47.86 53.72,47.23 v54.61,47.23 55.37,46.47 VREF.TP | 64.39,35.29 62.36,35.29 61.72,35.92 61.72,37.2 61.98,37.58 65.02,37.58 65.66,36.94 65.66,35.42 65.53,35.29 | 72.39,43.67 72.39,43.42 | 72.39,43.42 72.39,42.91 73.15,42.91 72.9,43.16 72.9,43.42 72.39,43.42 | 72.64,43.16 72.39,43.42
  Top 0.305: LM662.6 64.39,35.29 65.53,35.29 65.66,35.29 68.2,37.83 68.2,38.72 72.39,42.91 72.64,43.16 72.9,43.42 73.41,43.93
  Top 2.184: CSD18502-1.S 71.88,45.45 73.41,43.93 75.44,41.89 88.9,41.89 | CSD18502-2.S 89.66,42.66 88.9,41.89 | 88.9,41.89 88.9,31.48 83.82,26.4 RW2.P$2 RW.P$2
  Bottom 0.254: CSD18502-1.S 71.63,45.07 69.72,43.16 64.77,43.16 60.71,47.23 v54.61,47.23

### Text on the board
tNames: DUMM LOAD | 6V-12V | PGC | PGD | GND | VCC | MCLR | 3A MAX | 4A MAX | 5V | FAN | ¡Only connect / USB or DC at / the same time! | STATUS
bNames: https://github.com/CarlosRodriguezF/Dummy-Load